# EAGLE schematic Head (EAGLE 7.7.0)
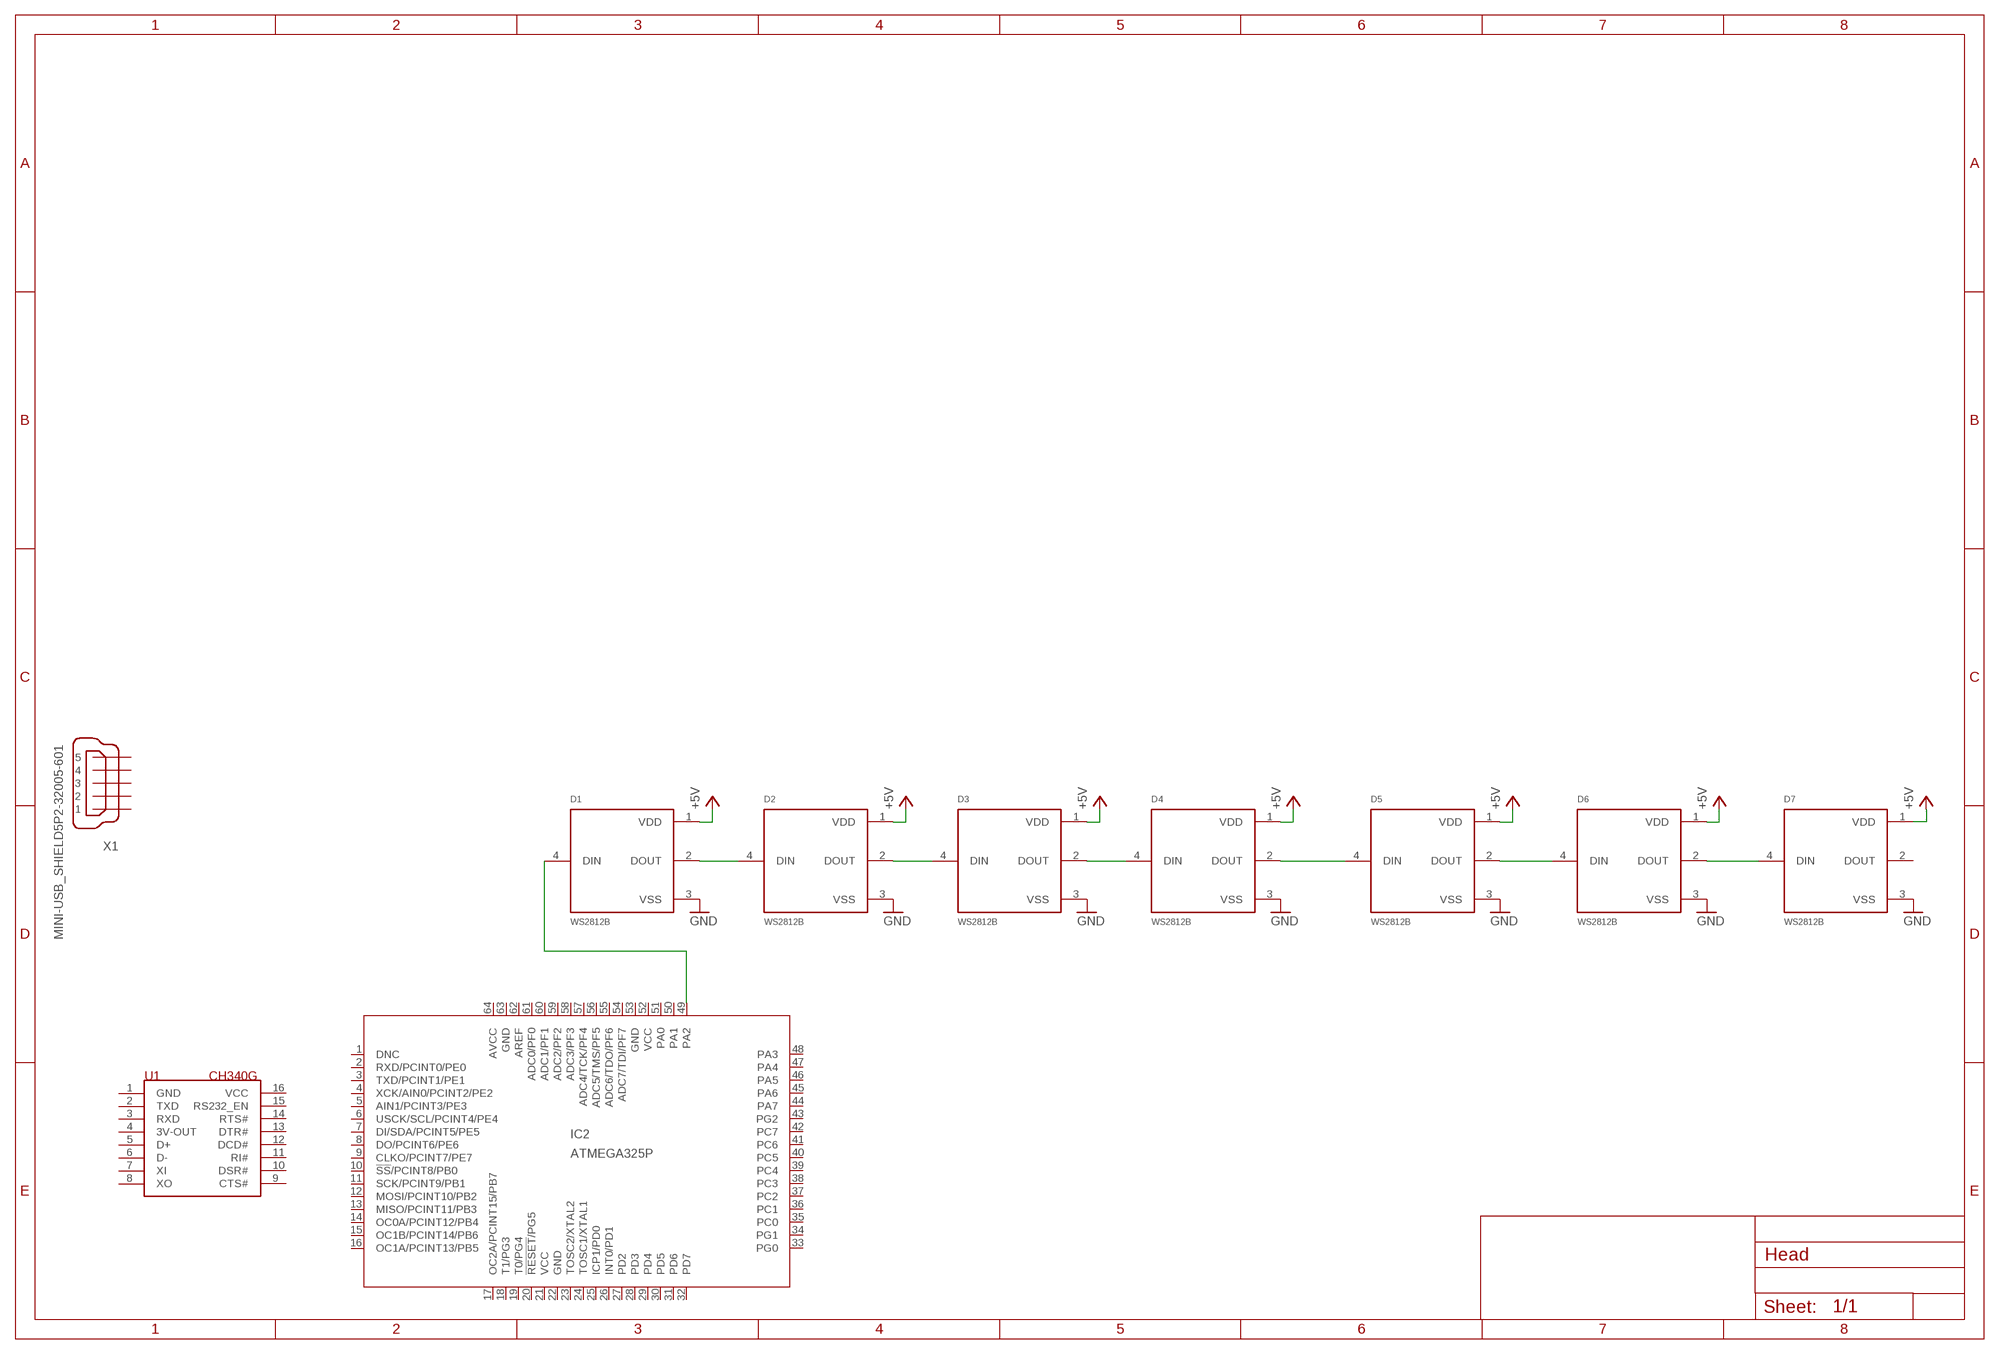
[diagram p0: schematic, sheet 1]

## Parts
D1  WS2812B  [LED_WS2812B]
D2  WS2812B  [LED_WS2812B]
D3  WS2812B  [LED_WS2812B]
D4  WS2812B  [LED_WS2812B]
D5  WS2812B  [LED_WS2812B]
D6  WS2812B  [LED_WS2812B]
D7  WS2812B  [LED_WS2812B]
IC2  ATMEGA325P  [64M1]
U1  CH340G  [SO-16]
X1  MINI-USB_SHIELD5P2-32005-601  [32005-601]

## Nets
0V: D1.3(VSS) D2.3(VSS) D3.3(VSS) D4.3(VSS) D5.3(VSS) D6.3(VSS) D7.3(VSS) ; supply symbol labelled GND
N$1: D1.2(DOUT) D2.4(DIN)
N$2: D2.2(DOUT) D3.4(DIN)
N$3: D3.2(DOUT) D4.4(DIN)
N$4: D4.2(DOUT) D5.4(DIN)
N$5: D5.2(DOUT) D6.4(DIN)
N$6: D6.2(DOUT) D7.4(DIN)
N$7: D1.4(DIN) IC2.49(PA2)
VCC: D1.1(VDD) D2.1(VDD) D3.1(VDD) D4.1(VDD) D5.1(VDD) D6.1(VDD) D7.1(VDD) ; supply symbol labelled +5V
Unconnected: D7.2(DOUT) IC2.1(DNC) IC2.2(RXD/PCINT0/PE0) IC2.3(TXD/PCINT1/PE1) IC2.4(XCK/AIN0/PCINT2/PE2) IC2.5(AIN1/PCINT3/PE3) IC2.6(USCK/SCL/PCINT4/PE4) IC2.7(DI/SDA/PCINT5/PE5) IC2.8(DO/PCINT6/PE6) IC2.9(CLKO/PCINT7/PE7) IC2.10(!SS!/PCINT8/PB0) IC2.11(SCK/PCINT9/PB1) IC2.12(MOSI/PCINT10/PB2) IC2.13(MISO/PCINT11/PB3) IC2.14(OC0A/PCINT12/PB4) IC2.15(OC1B/PCINT14/PB6) IC2.16(OC1A/PCINT13/PB5) IC2.17(OC2A/PCINT15/PB7) IC2.18(T1/PG3) IC2.19(T0/PG4) IC2.20(!RESET!/PG5) IC2.23(TOSC2/XTAL2) IC2.24(TOSC1/XTAL1) IC2.25(ICP1/PD0) IC2.26(INT0/PD1) IC2.27(PD2) IC2.28(PD3) IC2.29(PD4) IC2.30(PD5) IC2.31(PD6) IC2.32(PD7) IC2.33(PG0) IC2.34(PG1) IC2.35(PC0) IC2.36(PC1) IC2.37(PC2) IC2.38(PC3) IC2.39(PC4) IC2.40(PC5) IC2.41(PC6) IC2.42(PC7) IC2.43(PG2) IC2.44(PA7) IC2.45(PA6) IC2.46(PA5) IC2.47(PA4) IC2.48(PA3) IC2.50(PA1) IC2.51(PA0) IC2.54(ADC7/TDI/PF7) IC2.55(ADC6/TDO/PF6) IC2.56(ADC5/TMS/PF5) IC2.57(ADC4/TCK/PF4) IC2.58(ADC3/PF3) IC2.59(ADC2/PF2) IC2.60(ADC1/PF1) IC2.61(ADC0/PF0) IC2.62(AREF) U1.1(GND) U1.2(TXD) U1.3(RXD) U1.4(3V-OUT) U1.5(D+) U1.6(D-) U1.7(XI) U1.8(XO) U1.9(CTS#) U1.10(DSR#) U1.11(RI#) U1.12(DCD#) U1.13(DTR#) U1.14(RTS#) U1.15(RS232_EN) U1.16(VCC) X1.1 X1.2 X1.3 X1.4 X1.5 X1.M1(S1) X1.M2(S2)

## Power pins joined to a net without a drawn wire
AVCC: IC2.64(AVCC)
GND: IC2.22(GND) IC2.53(GND) IC2.63(GND)
VCC: IC2.21(VCC) IC2.52(VCC)

## Library data of the parts
D1-D7 = WS2812B:WS2812B: Ws2812b 5050 Rgb Led With Integrated Driver Chip Pack Of 10; AVAILABILITY: Unavailable; DESCRIPTION: Intelligent Control Led Integrated Light Source Pack Of 10; MF: Adafruit Industries; MP: WS2812B; PACKAGE: None; PRICE: 5.56 USD
IC2 = atmel:ATMEGA325P: 8-bit Microcontroller with 32K Bytes In-System Programmable Flash Source: http://www.atmel.com .. doc8023.pdf; MPN: ATMEGA325PV-10AU; OC_FARNELL: 1636939; OC_NEWARK: 03P2025
U1 = HumanoidLbr:CH340G
X1 = con-cypressindustries:MINI-USB_SHIELD5P2-: MINI USB-B R/A DIP 5pol. Source: www.cypressindustries.com; OC_FARNELL: unknown; OC_NEWARK: unknown